# EasyEDA schematic LcsNodes-Building-Block-LCS-Bus-DCC-Signals-2.json
TITLE: LCS Bus - DCC Signal Input; REV: 1.1; Date: 2023-09-17; Sheet: 1/1; Drawn By: helmut-f; Company: Your Company
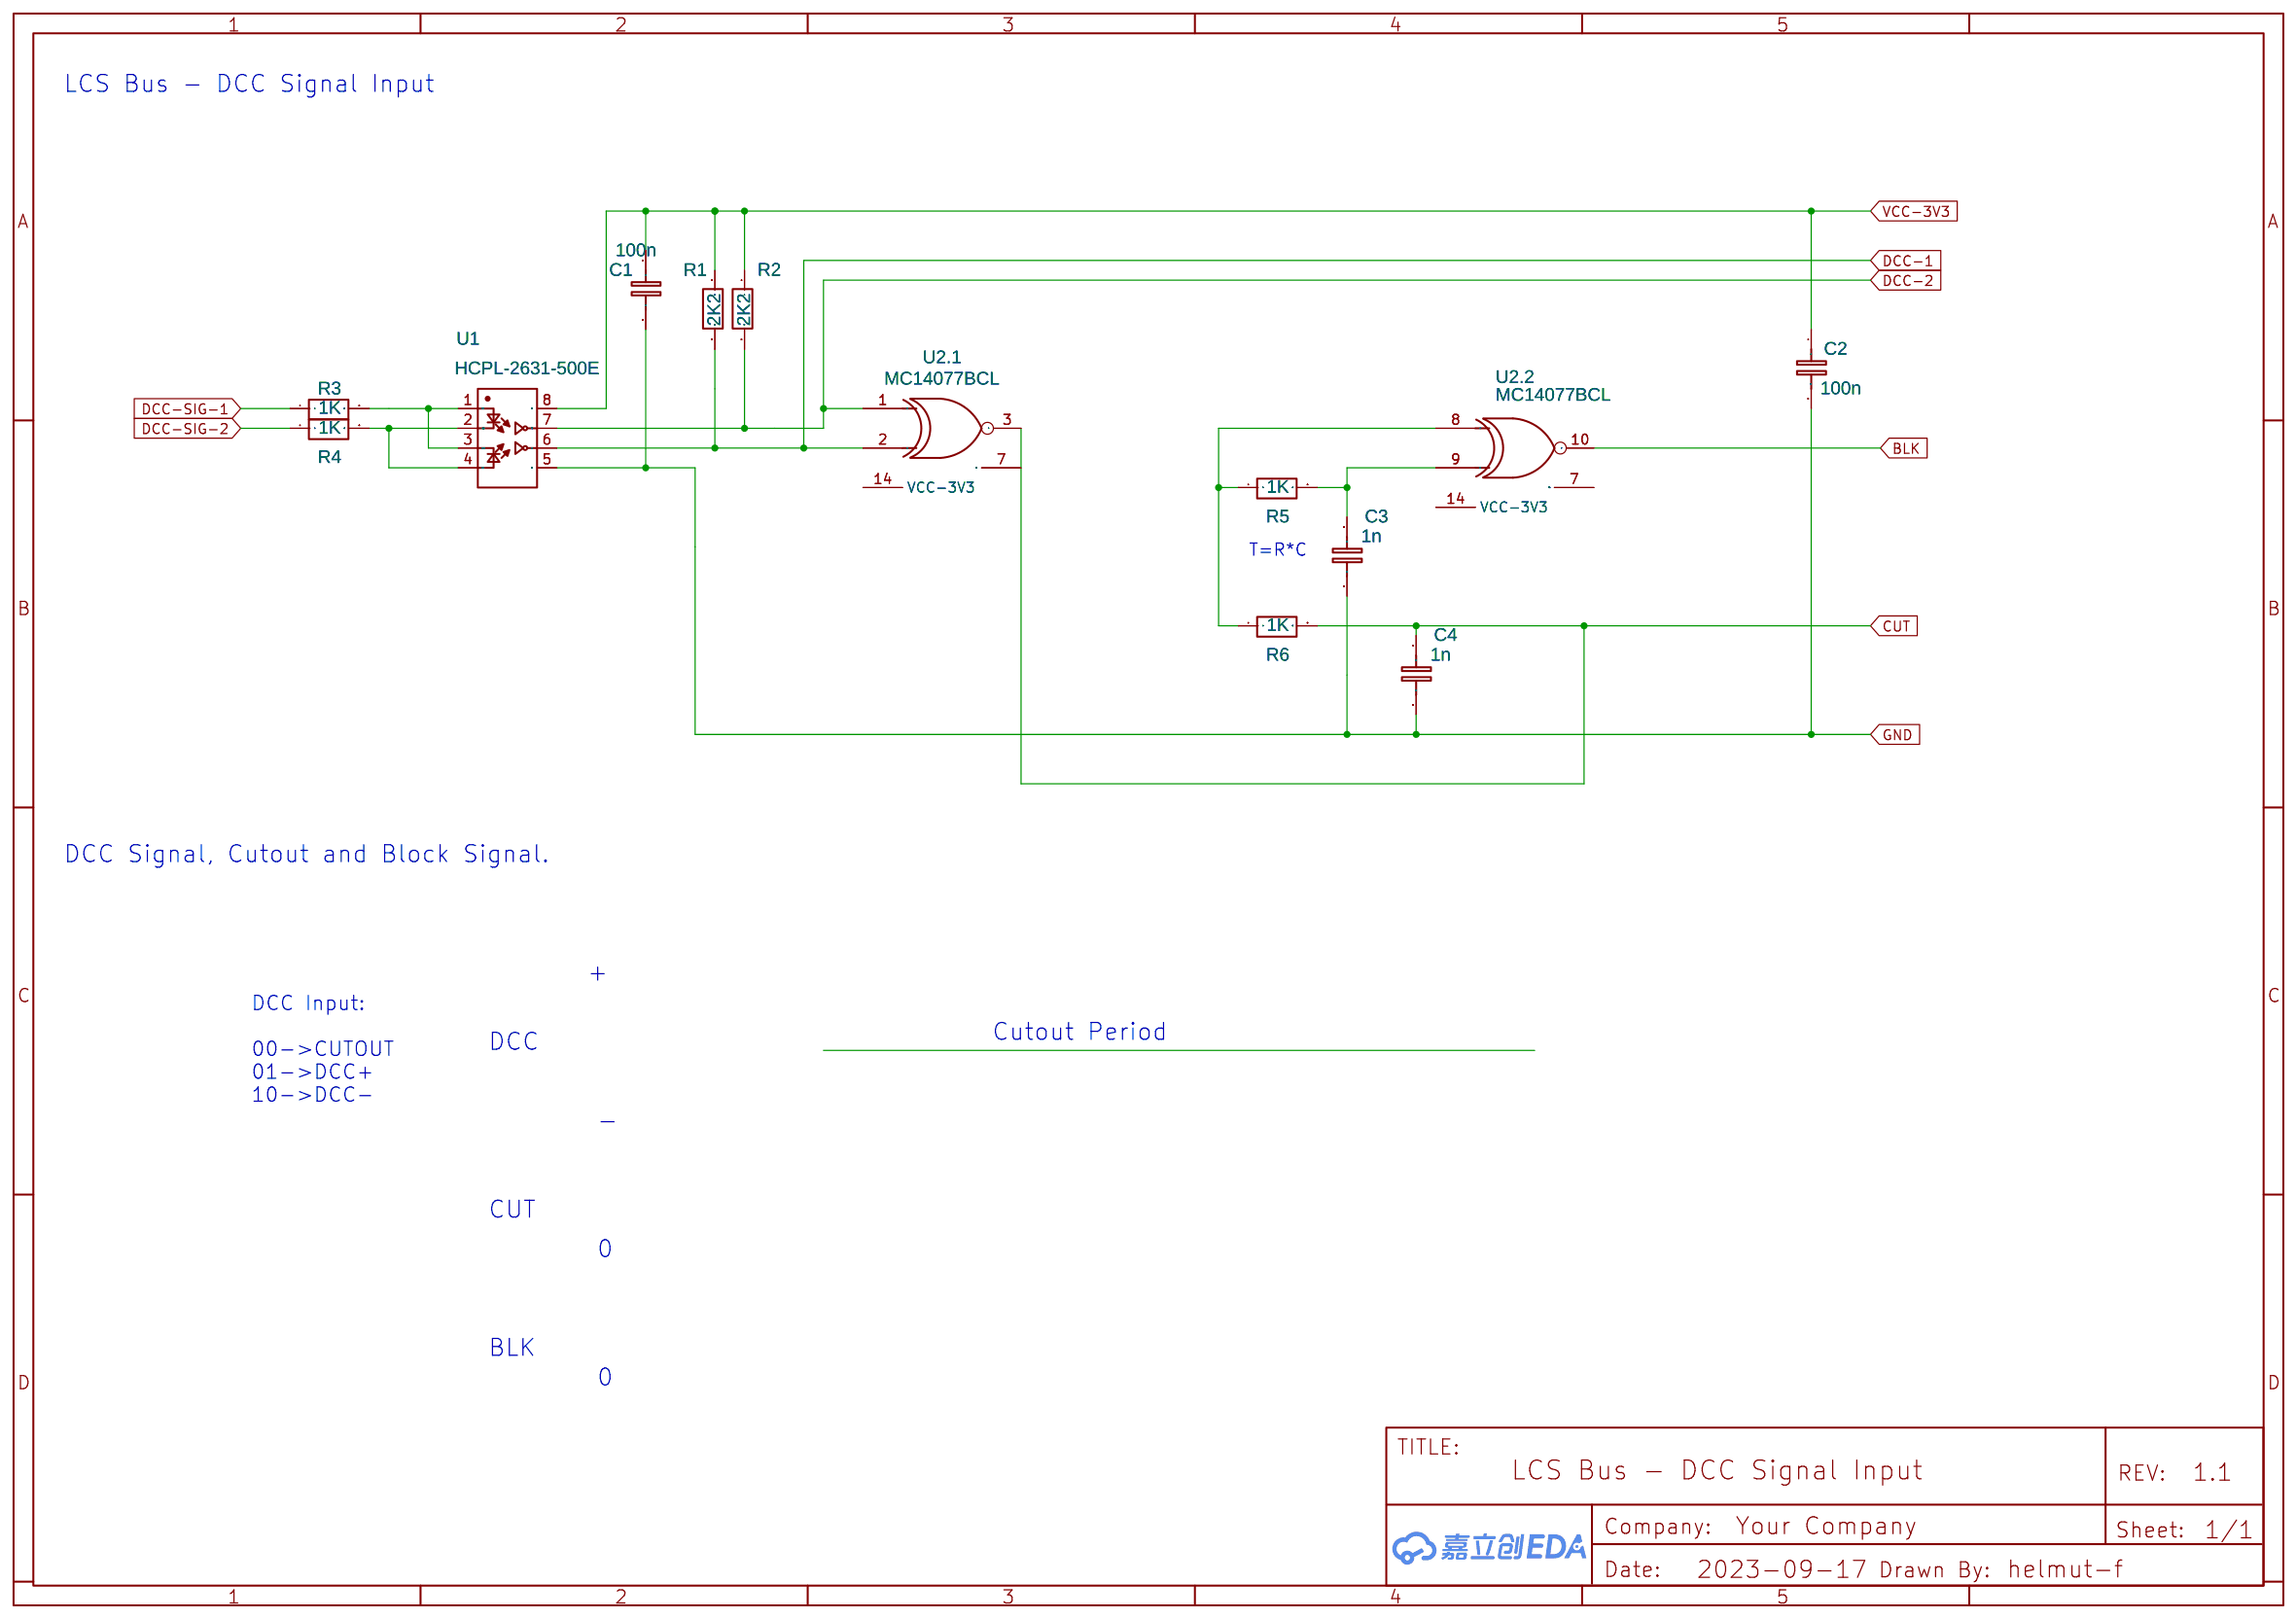
[diagram p0: schematic sheet]

## Parts
C1  100n  [C1206]
C2  100n  [C1206]
C3  1n  [1206]
C4  1n  [1206]
R1  2K2  [1206]
R2  2K2  [1206]
R3  1K  [1206]
R4  1K  [1206]
R5  1K  [1206]
R6  1K  [1206]
U1  HCPL-2631-500E  [OPTO-SMD-8P_L9.7-W6.4-P2.54-LS9.7-BL]
U2  MC14077BCL  [SO-14_L8.6-W3.9-P1.27-LS6.0-BL]  (sections 1,2)

## Library data of the parts
C1-C4 = C_0603_EU: Contributor: LCEDA_Lib; Package Display: No
R1 R3-R6 = R_AXIAL-0.3_EU: Contributor: LCEDA_Lib
R2 = R_AXIAL-0.3_EU: Contributor: LCEDA_Lib; Package Display: No
U1 = HCPL-2631-500E: Contributor: LCSC; Supplier: LCSC; Supplier Part: C188742; Manufacturer: AVAGO(安华高); JLCPCB Part Class: Extended Part; link: https://lcsc.com/eda_search?q=C188742&%26type=1&ref=editor
U2 = MC14077BCL: Quad XNOR Gate; subpart_no: 1; Package Display: No

## Nets
GND: C1.2 C2.2 C3.2 C4.2 U1.5(GND)
VCC-3V3: C1.1 C2.1 R1.1 R2.1 U1.8(VCC)
BLK: U2.10(Y)
CUT: C4.1 R6.2 U2.3(Y)
DCC-1: R1.2 U1.6(VO2) U2.2(B)
DCC-2: R2.2 U1.7(VO1) U2.1(A)
DCC-SIG-1: R3.1
DCC-SIG-2: R4.1
Net-(C3-1): C3.1 R5.2 U2.9(B)
Net-(R3-2): R3.2 U1.1(ANODE 1) U1.3(CATHODE 2)
Net-(R4-2): R4.2 U1.2(CATHODE 1) U1.4(ANODE 2)
Net-(R5-1): R5.1 R6.1 U2.8(A)

Not connected (* = marked no-connect by the designer): U2 7(GND) 14(VCC-3V3)

## Notes on the sheet
- LCS Bus - DCC Signal Input
- T=R*C
- DCC Signal, Cutout and Block Signal.
- +
- DCC Input:
  00->CUTOUT
  01->DCC+
  10->DCC-
- Cutout Period
- DCC
- -
- CUT
- 0
- BLK
- 0
